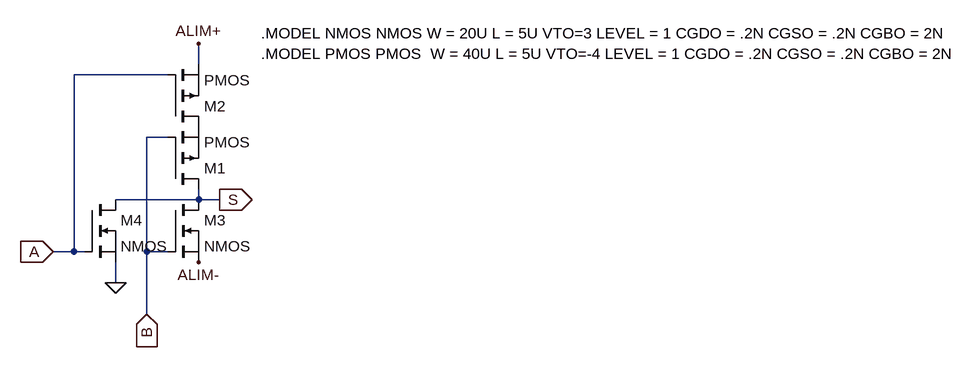
[diagram p0: schematic 74HC00.asc]
74HC00.asc, the LTspice schematic file:
Version 4
SHEET 1 1612 680
WIRE 304 16 304 -16
WIRE 256 32 112 32
WIRE 256 128 224 128
WIRE 304 224 304 208
WIRE 304 224 176 224
WIRE 336 224 304 224
WIRE 112 304 112 32
WIRE 112 304 80 304
WIRE 128 304 112 304
WIRE 224 304 224 128
WIRE 256 304 224 304
WIRE 176 352 176 320
WIRE 224 400 224 304
FLAG 336 224 S
IOPIN 336 224 Out
FLAG 224 400 B
IOPIN 224 400 In
FLAG 176 352 0
FLAG 80 304 A
IOPIN 80 304 In
FLAG 304 -16 ALIM+
FLAG 304 320 ALIM-
SYMBOL pmos 256 112 M180
SYMATTR InstName M2
SYMBOL pmos 256 208 M180
SYMATTR InstName M1
SYMBOL nmos 256 224 R0
SYMATTR InstName M3
SYMBOL nmos 128 224 R0
SYMATTR InstName M4
TEXT 400 -32 Left 0 !.MODEL NMOS NMOS W = 20U L = 5U VTO=3 LEVEL = 1 CGDO = .2N CGSO = .2N CGBO = 2N\n.MODEL PMOS PMOS  W = 40U L = 5U VTO=-4 LEVEL = 1 CGDO = .2N CGSO = .2N CGBO = 2N

The netlist it stands for:
* 74HC00.asc
M2 P001 A ALIM+ ALIM+ PMOS
M1 S B P001 P001 PMOS
M3 S B ALIM- ALIM- NMOS
M4 S A 0 0 NMOS
.model NMOS NMOS
.model PMOS PMOS
.lib standard.mos
.MODEL NMOS NMOS W = 20U L = 5U VTO=3 LEVEL = 1 CGDO = .2N CGSO = .2N CGBO = 2N
.MODEL PMOS PMOS  W = 40U L = 5U VTO=-4 LEVEL = 1 CGDO = .2N CGSO = .2N CGBO = 2N
.backanno
.end